# Altium schematic sheet USB-C.SchDoc
size A4
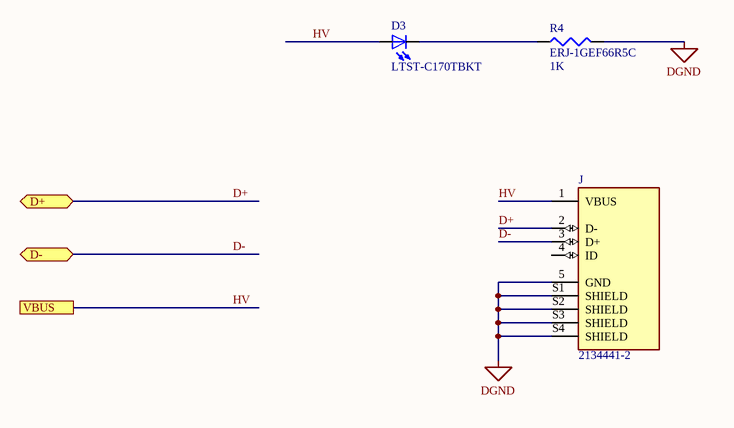
[diagram p0: USB-C.SchDoc]

## Parts
D3  LTST-C170TBKT  [DIOC200X125X110]
J  2134441-2  [TE_2134441-2]
R4  ERJ-1GEF66R5C  value 1K  [J1-0603]

## Ports
D+ (bidir), D- (bidir), VBUS

## Nets
DGND: J.5(GND) J.S1(SHIELD) J.S2(SHIELD) J.S3(SHIELD) J.S4(SHIELD) R4.2
D+: J.2(D-) ; port D+
D-: J.3(D+) ; port D-
HV: D3.POS J.1(VBUS) ; port VBUS
NetD3_NEG: D3.NEG R4.1

Not connected (* = marked no-connect by the designer): J 4(ID)

## Library data of the parts
D3 = LTST-C170TBKT: Blue 470nm LED Indication - Discrete 3.3V 0805 _2012 Metric_; MF: Lite-On Inc.; SnapEDA_Link: https://www.snapeda.com/parts/LTST-C170TBKT/Lite-On%20Inc./view-part/217848/?ref=snap; MP: LTST-C170TBKT; Value: *; Digi-Key_Part_Number: 160-1579-1-ND; Digi-Key_Purchase_URL: https://www.digikey.jp/product-detail/en/lite-on-inc/LTST-C170TBKT/160-1579-1-ND/564889?utm_source=snapeda&utm_medium=aggregator&utm_campaign=symbol; Package: 0805 Lite-On
J = 2134441-2: Conn Micro USB RCP 5 POS 0.65mm Solder RA SMD 5 Terminal 1 Port T/R; MF: TE Connectivity; Digi-Key_Purchase_URL: https://www.digikey.com/product-detail/en/te-connectivity-amp-connectors/2134441-2/A118104CT-ND/4729911?utm_source=snapeda&utm_medium=aggregator&utm_campaign=symbol; Digi-Key_Part_Number: A118104CT-ND; TE_purchase_URL: https://www.te.com/usa-en/product-2134441-2.html?te_bu=Cor&te_type=disp&te_campaign=seda_glo_cor-seda-global-disp-prtnr-fy19-seda-model-bom-cta_sma-317_1&elqCampaignId=32493; Value: *; MP: 2134441-2; Package: None; SnapEDA_Link: https://www.snapeda.com/parts/2134441-2/TE%20Connectivity%20AMP%20Connectors/view-part/515262/?ref=snap
R4 = Res3: Resistor; Published: 8-Jun-2000; LatestRevisionDate: 29-May-2009; LatestRevisionNote: IPC-7351 Footprint Added.; PackageReference: J1-0603; Publisher: Altium Limited; PackageDescription: Chip Resistor